# EAGLE design motorcontrol (EAGLE 6.5.0)
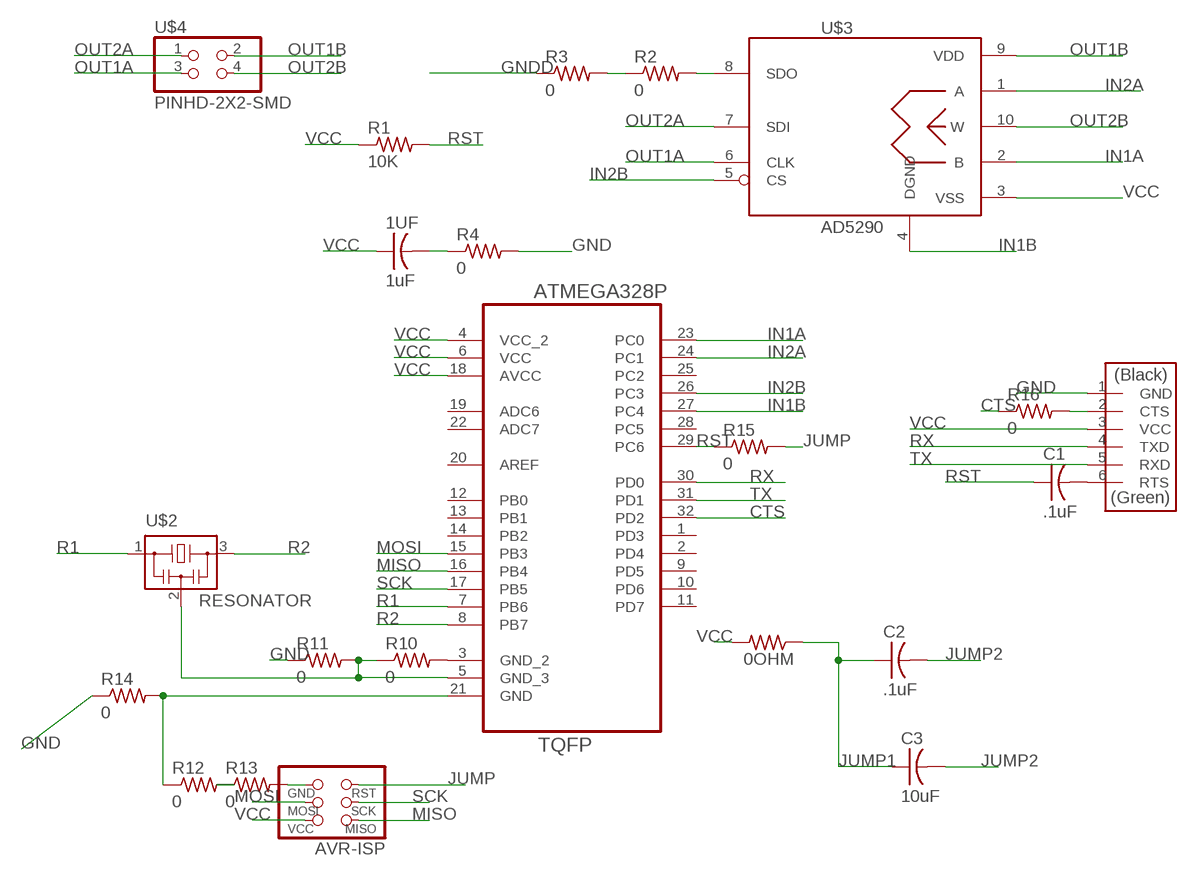
[diagram p0: schematic, sheet 1]

## Parts
0OHM  RES-US1206FAB  [R1206FAB]
1UF  1uF  CAP-US1206FAB  [C1206FAB]
AVR-ISP  AVRISPSMD  [2X03SMD]
C1  .1uF  CAP-US1206FAB  [C1206FAB]
C2  .1uF  CAP-US1206FAB  [C1206FAB]
C3  10uF  CAP-US1206FAB  [C1206FAB]
R1  10K  RES-US1206FAB  [R1206FAB]
R2  0  RES-US1206FAB  [R1206FAB]
R3  0  RES-US1206FAB  [R1206FAB]
R4  0  RES-US1206FAB  [R1206FAB]
R10  0  RES-US1206FAB  [R1206FAB]
R11  0  RES-US1206FAB  [R1206FAB]
R12  0  RES-US1206  [R1206]
R13  0  RES-US1206  [R1206]
R14  0  RES-US1206FAB  [R1206FAB]
R15  0  RES-US1206FAB  [R1206FAB]
R16  0  RES-US1206FAB  [R1206FAB]
U1  ATMEGA328P-AU  [QFP80P900X900X120-32N]
U$1  FTDI-SMD-HEADER  [1X06SMD]
U$2  RESONATOR  [EFOBM]
U$3  AD5290  [MSOP_10]
U$4  PINHD-2X2-SMD  [2X02SMD]

## Nets
CTS: R16.1 U1.32(PD2)
GNA: R10.1 R11.2 U1.5(GND_3) U$2.2
GND: R4.2 R11.1 R14.1 U$1.1(GND)
GNDD: R3.1 R12.1 R14.2 U1.21(GND)
IN1A: U1.23(PC0) U$3.2(B)
IN1B: U1.27(PC4) U$3.4(DGND)
IN2A: U1.24(PC1) U$3.1(A)
IN2B: U1.26(PC3) U$3.5(CS)
JUMP: AVR-ISP.5(RST) R15.2
JUMP1: 0OHM.1 C2.1 C3.1
JUMP2: C2.2 C3.2 R2.2 U$3.8(SDO)
MISO: AVR-ISP.1(MISO) U1.16(PB4)
MOSI: AVR-ISP.4(MOSI) U1.15(PB3)
N$6: R10.2 U1.3(GND_2)
N$7: R16.2 U$1.2(CTS)
N$8: AVR-ISP.6(GND) R13.2
N$10: C1.2 U$1.6(RTS)
N$11: R2.1 R3.2
N$12: 1UF.2 R4.1
N$13: R12.2 R13.1
OUT1A: U$3.6(CLK) U$4.3
OUT1B: U$3.9(VDD) U$4.2
OUT2A: U$3.7(SDI) U$4.1
OUT2B: U$3.10(W) U$4.4
R1: U1.7(PB6) U$2.1
R2: U1.8(PB7) U$2.3
RST: C1.1 R1.2 R15.1 U1.29(PC6)
RX: U1.30(PD0) U$1.4(TXD)
SCK: AVR-ISP.3(SCK) U1.17(PB5)
TX: U1.31(PD1) U$1.5(RXD)
VCC: 0OHM.2 1UF.1 AVR-ISP.2(VCC) R1.1 U1.4(VCC_2) U1.6(VCC) U1.18(AVCC) U$1.3(VCC) U$3.3(VSS)
Unconnected: U1.1(PD3) U1.2(PD4) U1.9(PD5) U1.10(PD6) U1.11(PD7) U1.12(PB0) U1.13(PB1) U1.14(PB2) U1.19(ADC6) U1.20(AREF) U1.22(ADC7) U1.25(PC2) U1.28(PC5)

## Library data of the parts
0OHM R1-R4 R10-R16 = fab:RES-US: Resistor (US Symbol) Variants with postfix FAB are widened to allow the routing of internal traces
1UF C1-C3 = fab:CAP-US
AVR-ISP = fab:AVRISP
U1 = fab:ATMEGA328P-AU; DESCRIPTION: 8-bit Microcontroller with In-System Programmable Flash; MPN: ATMEGA328P-AU; OC_FARNELL: 1715486; OC_NEWARK: 14R4631; PACKAGE: TQFP-32; SUPPLIER: Atmel
U$1 = fab:FTDI-SMD-HEADER
U$2 = fab:RESONATOR
U$3 = BillPorter:AD5290: AD5290 SPI Compact +30 V / ±15 V 256-Position Digital Potentiometer in a 10-TFSOP, 10-MSOP package. Specs @ http://www.analog.com/en/digital-to-analog-converters/digital-potentiometers/ad5290/products/product.html
U$4 = fab:PINHD-2X2-SMD

## Board
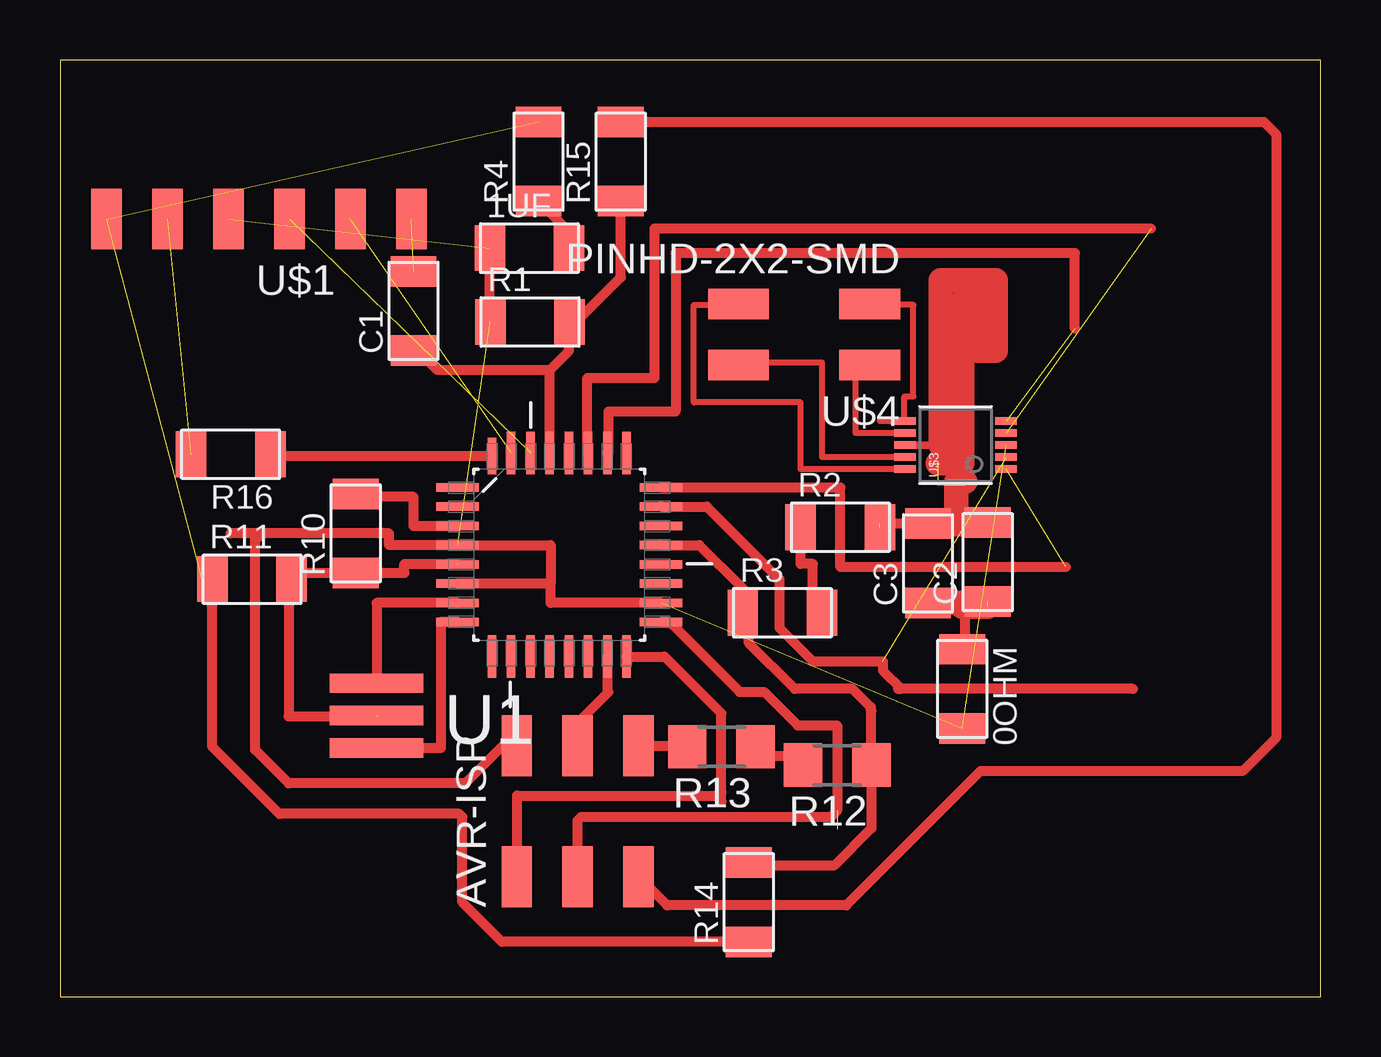
[diagram p1: board, top side]
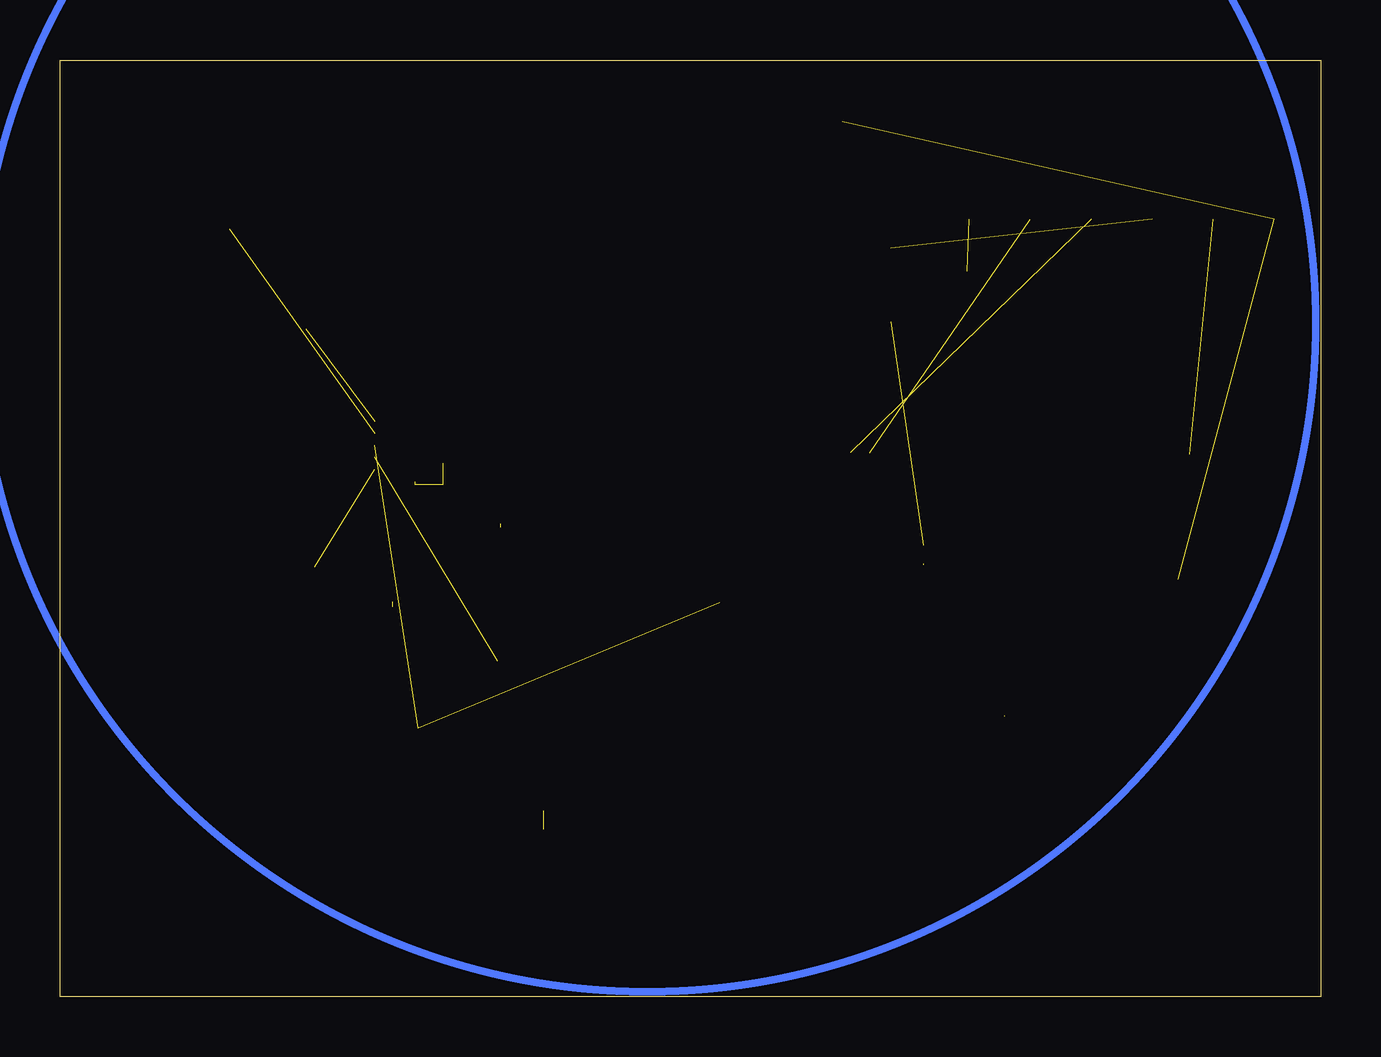
[diagram p2: board, bottom side, seen from below]

Size 52.53 x 39.03 mm. Coordinates in mm from the lower left corner, seen from the top.
Outline: 0,0 52.53,0 52.53,39.03 0,39.03 0,0
Copper layers (1*16): Top 0.035mm / dielectric 1.5mm / Bottom 0.035mm
Design rules "default *": minimum track width 10mil, minimum drill 24mil, track to track 16mil, track to pad 16mil, pad to pad 16mil, via to via 16mil, smd to smd 16mil, copper to edge 40mil, drill to drill 16mil, minimum pad ring 10mil, minimum via ring 8mil, stop-mask expansion 4mil, vias tented up to drill 0mil, thermal gap 10mil

### Footprints (pad centres in the part's own frame; a part is rotated, then mirrored left to right if it is on the bottom)
R1206FAB = smd 1.27 x 1.905: 1 -1.651,0; 2 1.651,0
C1206FAB = smd 1.27 x 1.905: 1 -1.651,0; 2 1.651,0
2X03SMD = smd 2.54 x 1.27: 1 -2.54,2.54; 2 2.92,2.54; 3 -2.54,0; 4 2.92,0; 5 -2.54,-2.54; 6 2.92,-2.54
R1206 = smd 1.6 x 1.803: 1 -1.422,0; 2 1.422,0
QFP80P900X900X120-32N = smd 1.778 x 0.356: 1 -4.242,2.794; 2 -4.242,2.007; 3 -4.242,1.194; 4 -4.242,0.406; 5 -4.242,-0.406; 6 -4.242,-1.194; 7 -4.242,-2.007; 8 -4.242,-2.794; 17 4.242,-2.794; 18 4.242,-2.007; 19 4.242,-1.194; 20 4.242,-0.406; 21 4.242,0.406; 22 4.242,1.194; 23 4.242,2.007; 24 4.242,2.794 | smd 0.356 x 1.778: 9 -2.794,-4.242; 10 -2.007,-4.242; 11 -1.194,-4.242; 12 -0.406,-4.242; 13 0.406,-4.242; 14 1.194,-4.242; 15 2.007,-4.242; 16 2.794,-4.242; 25 2.794,4.242; 26 2.007,4.242; 27 1.194,4.242; 28 0.406,4.242; 29 -0.406,4.242; 30 -1.194,4.242; 31 -2.007,4.242 | smd 0.356 x 1.524: 32 -2.794,4.115
1X06SMD = smd 2.54 x 1.27: 1 0,6.35; 2 0,3.81; 3 0,1.27; 4 0,-1.27; 5 0,-3.81; 6 0,-6.35
EFOBM = smd 0.8 x 3.9: 1 -1.35,0; 2 0,0; 3 1.35,0
MSOP_10 = smd 0.305 x 0.889: 1 -1,-2.11; 2 -0.5,-2.11; 3 0,-2.11; 4 0.5,-2.11; 5 1,-2.11; 6 1,2.11; 7 0.5,2.11; 8 0,2.11; 9 -0.5,2.11; 10 -1,2.11
2X02SMD = smd 2.54 x 1.27: 1 -2.54,1.27; 2 2.92,1.27; 3 -2.54,-1.27; 4 2.92,-1.27

### Placement (x,y rotation side)
0OHM  37.59,12.83 270 top
1UF  19.56,31.19 0 top
AVR-ISP  21.57,7.53 90 top
C1  14.73,28.57 90 top
C2  38.66,18.11 90 top
C3  36.17,18.06 90 top
R1  19.58,28.12 0 top
R2  32.51,19.56 0 top
R3  30.1,16 0 top
R4  19.94,34.8 90 top
R10  12.32,19.3 90 top
R11  8,17.4 0 top
R12  32.38,9.65 180 top
R13  27.56,10.41 180 top
R14  28.7,3.94 90 top
R15  23.37,34.8 90 top
R16  7.11,22.61 180 top
U1  20.8,18.41 0 top
U$1  8.29,32.4 90 top
U$2  13.19,11.72 270 top
U$3  37.31,22.99 90 top
U$4  31.19,27.58 180 top

### Tracks (layer width: path | path; a pad name or v marks a point on that pad's centre or on a via)
CTS
  Top 0.406: U1.32 8.84,22.53 R16.1
GNA  (2 unrouted)
  Top 0.406: 16.56,18.03 14.35,18.03 14.35,17.65 R10.1 9.65,17.65 R11.2 9.53,17.4 9.53,11.68 13.19,11.68
GND  (2 unrouted)
  Top 0.406: 5.94,17.4 R11.1 6.35,10.41 9.14,7.62 16.64,7.62 16.76,7.49 16.76,3.94 18.41,2.29 R14.1
GNDD
  Top 0.406: U1.21 26.64,18.82 28.45,17.02 R3.1 28.7,15.75 28.7,14.73 30.61,12.83 33.02,12.83 33.78,12.06 33.78,11.94 33.81,11.91 R12.1 33.81,7.01 32.26,5.46 28.83,5.46 R14.2
IN1A  (1 unrouted)
  Top 0.406: 44.7,12.83 35.05,12.83 | 35.05,12.83 34.92,12.83 | U1.23 26.95,20.42 29.97,17.4 29.97,15.37 31.37,13.97 34.29,13.97 34.29,13.59 35.05,12.83
IN1B  (1 unrouted)
  Top 0.406: 45.47,32 24.77,32 24.77,25.78 21.97,25.78 21.97,22.66 U1.27
IN2A  (1 unrouted)
  Top 0.406: U1.24 32.51,21.21 32.51,17.91 41.91,17.91
IN2B  (1 unrouted)
  Top 0.406: U1.26 22.86,22.66 22.86,24.38 25.65,24.38 25.65,30.99 42.29,30.99 42.29,27.84
JUMP
  Top 0.406: R15.2 50.16,36.45 50.67,35.94 50.67,10.79 49.28,9.4 38.35,9.4 32.77,3.81 25.29,3.81 AVR-ISP.5
JUMP1  (1 unrouted)
  Top 0.406: 0OHM.1 37.72,14.48 37.72,16.26
  Top 1.016: 38.66,16.26 37.72,16.26 37.59,16.26 37.59,16.41 C3.1
JUMP2  (4 unrouted)
  Top 0.254: 38.66,19.68 C2.2
  Top 0.305: U$3.8 36.58,22.99 36.7,23.11
  Top 0.406: C3.2 34.16,19.71
  Top 1.016: 37.34,22.99 36.7,22.99 36.7,23.11 36.7,29.84 38.99,29.84 38.99,26.92 38.23,26.92 38.23,28.96 37.59,28.96 37.59,22.23 36.58,22.23 | 37.72,21.46 37.34,21.46 37.34,19.71 | 38.66,19.68 37.34,19.68 37.34,19.71 | C3.2 37.34,19.71
MISO
  Top 0.406: AVR-ISP.1 19.05,4.99 19.05,8.38 27.43,8.38 27.56,8.51 | 27.56,8.13 27.56,8.51 | 27.56,8.51 27.56,11.81 25.2,14.17 U1.16
MOSI
  Top 0.406: U1.15 22.81,12.75 22.86,12.7 21.57,11.41 AVR-ISP.4
N$6
  Top 0.406: U1.3 14.73,19.61 14.73,20.83 12.32,20.83 R10.2
N$7  (1 unrouted)
N$8
  Top 0.406: AVR-ISP.6 26.14,10.45 R13.2
N$10  (1 unrouted)
N$11
  Top 0.406: R3.2 31.37,16 31.37,18.03 30.86,18.03 R2.1
N$12
  Top 0.406: 1UF.2 21.21,31.88 R4.1
N$13
  Top 0.406: R13.1 29.08,10.41 29.08,10.03 30.96,10.03 R12.2
OUT1A
  Top 0.254: U$3.6 34.16,23.99 34.16,24 35.18,24 35.18,25.02 35.56,25.02 35.56,28.83 33.73,28.83 U$4.3
OUT1B
  Top 0.254: U$3.9 31.75,22.49 31.75,26.42 28.27,26.42 U$4.2
OUT2A
  Top 0.254: U$3.7 33.15,23.49 33.15,26.29 33.73,26.29 U$4.1
OUT2B
  Top 0.254: U$3.10 30.86,21.99 30.86,24.77 26.42,24.77 26.42,28.83 28.27,28.83 U$4.4
R1
  Top 0.406: U1.7 13.19,16.41 U$2.1
R2
  Top 0.406: U$2.3 15.88,10.37 15.88,15.62 U1.8
RST
  Top 0.406: U1.29 20.4,26.11 | 20.4,26.11 21.21,26.92 21.21,28.09 R1.2 21.51,28.12 23.37,29.97 R15.1 | 20.4,26.11 15.73,26.11 14.92,26.92 C1.1
RX  (1 unrouted)
SCK  (1 unrouted)
  Top 0.406: U1.17 25.4,15.62 28.32,12.7 29.34,12.7 30.73,11.3 32.38,11.3 32.38,7.75 32.13,7.49 21.72,7.49 21.57,7.35 AVR-ISP.3
TX  (1 unrouted)
VCC  (4 unrouted)
  Top 0.406: R1.1 17.91,28.12 1UF.1 | 8.38,19.3 13.72,19.3 13.72,18.82 U1.4 20.45,18.82 20.45,17.22 | 8.38,19.3 7.11,19.3 | U1.18 20.45,16.41 20.45,17.22 | U1.6 20.45,17.22 | AVR-ISP.2 18.45,10.45 16.89,8.89 9.53,8.89 8.13,10.29 8.13,19.05 8.38,19.3 | 6.73,32.06 U$1.3
(copper drawn outside any net)
  shapes: Bottom circle x1